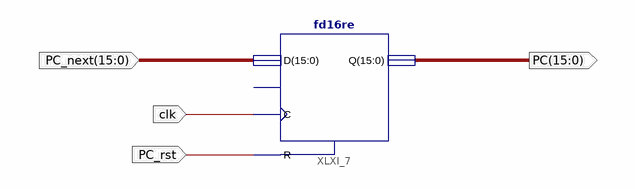
[diagram p0: schematic sheet 1]
// Xilinx ISE schematic PC.sch (spartan3e) as structural Verilog: 1 symbols, 4 ports
module PC (
  input  clk,
  input  PC_rst,
  input  [15:0] PC_next,
  output [15:0] PC
);

  fd16re XLXI_7 (.C(clk), .D(PC_next), .R(PC_rst), .Q(PC));  // open: CE
endmodule
